# EAGLE schematic PiGateway2 (EAGLE 7.6.0)
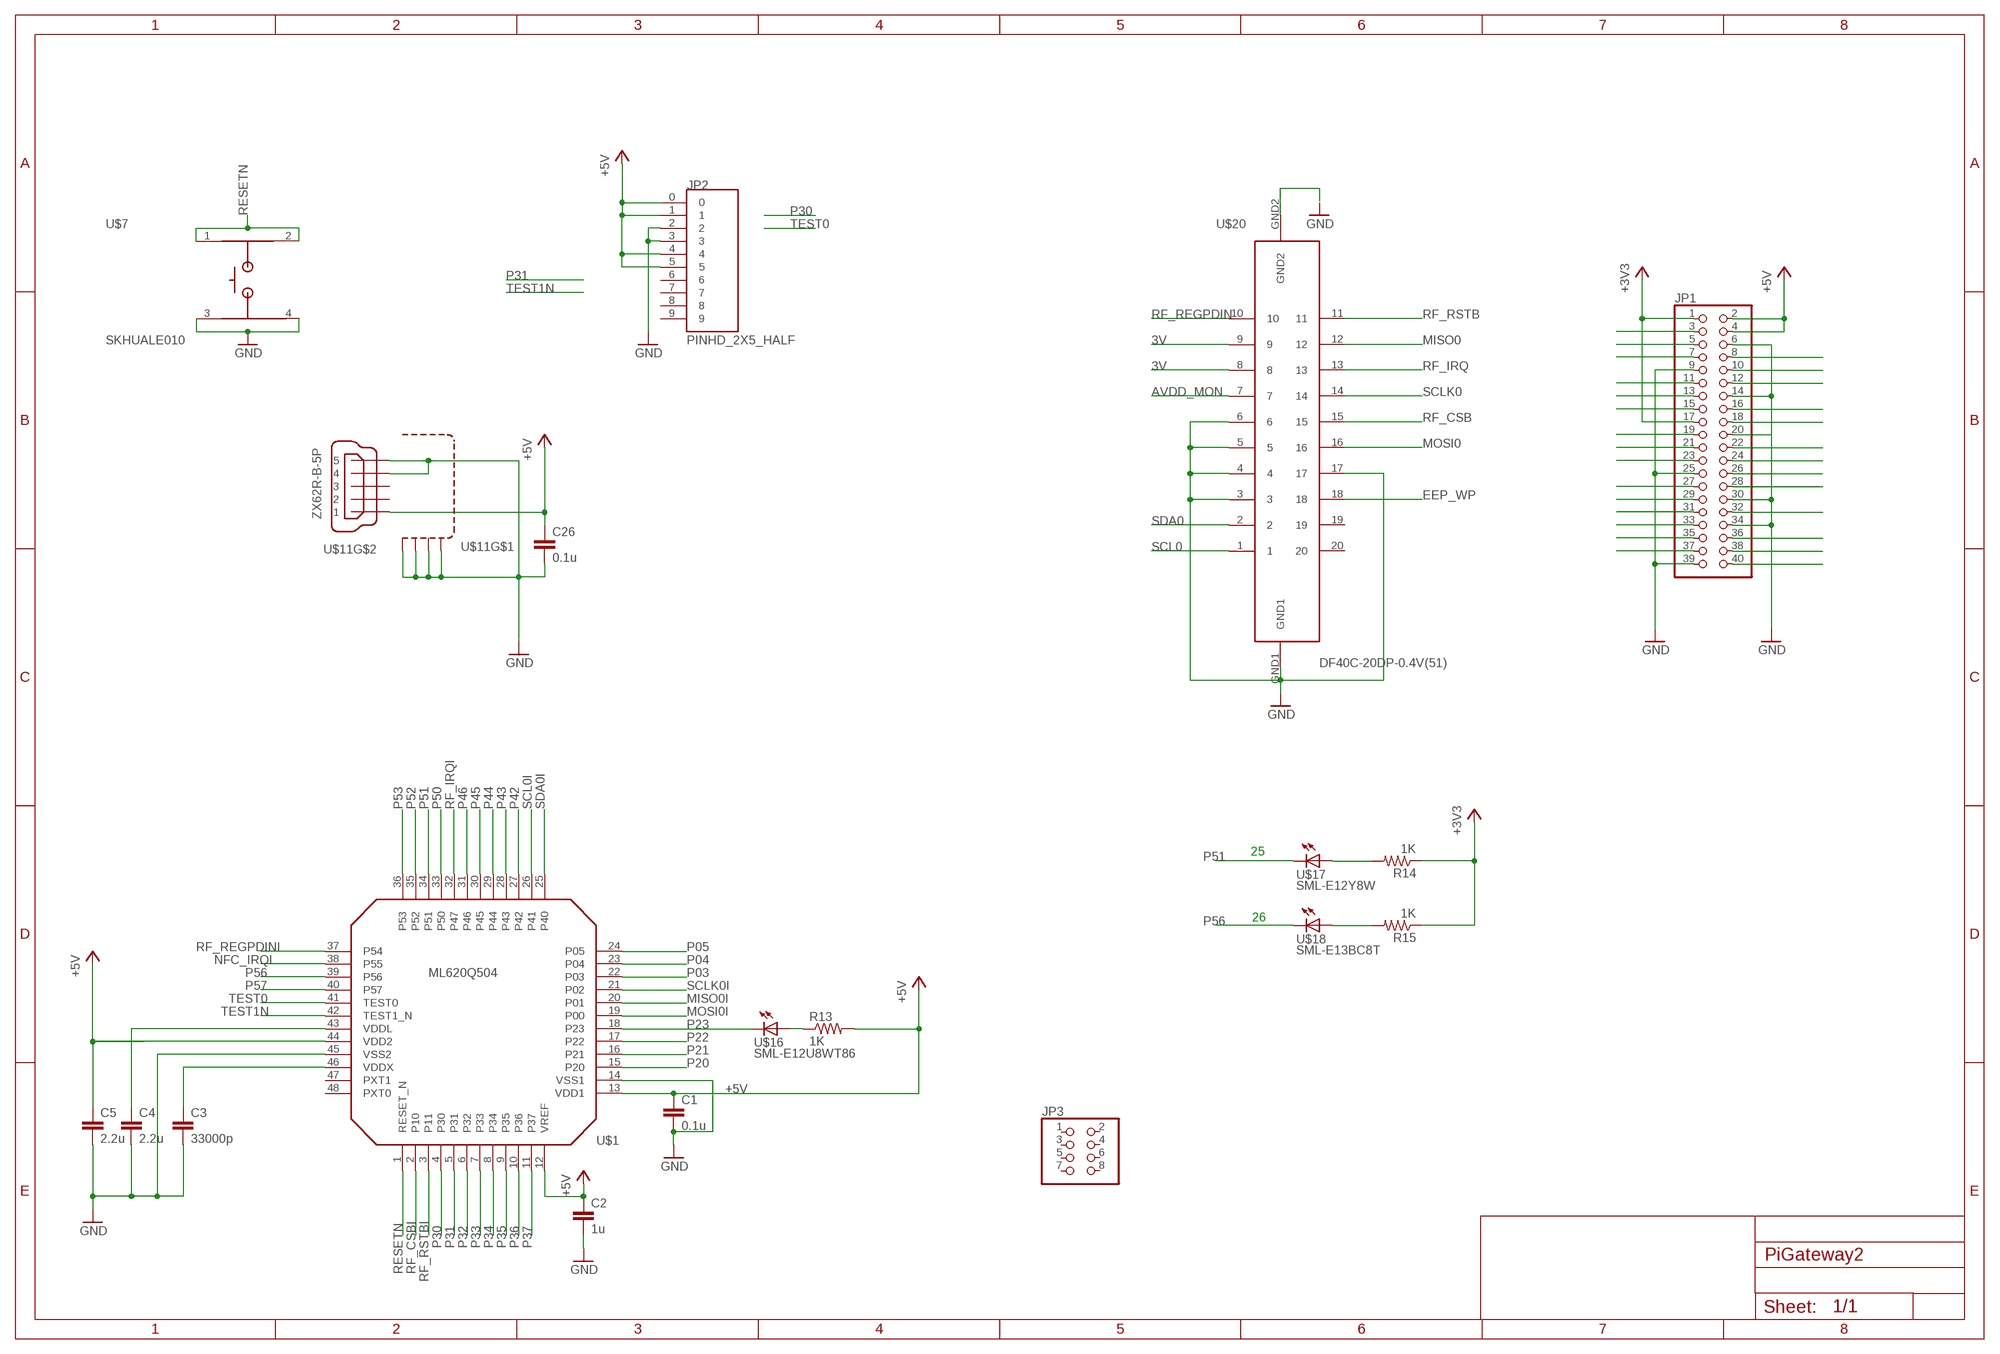
[diagram p0: schematic, sheet 1]

## Parts
C1  0.1u  C-EUC0402  [C0402]
C2  1u  C-EUC0402  [C0402]
C3  33000p  C-EUC0402  [C0402]
C4  2.2u  C-EUC0402  [C0402]
C5  2.2u  C-EUC0402  [C0402]
C26  0.1u  C-EUC0402  [C0402]
JP1  PINHD-2X20  [2X20]
JP2  PINHD_2X5_HALF  [PINHD_2X5_HALF]
JP3  PINHD-2X4  [2X04]
R13  1K  R-US_R0402  [R0402]
R14  1K  R-US_R0402  [R0402]
R15  1K  R-US_R0402  [R0402]
U$1  ML620Q504  [ML620Q504]
U$7  SKHUALE010  [SKHUALE010]
U$11  ZX62R-B-5P  MICRO-USB-SHIELD-ZX62R-B-5P  [ZX62R-B-5P]
U$16  SML-E12U8WT86  SML-E1X  [SML-E1X]
U$17  SML-E12Y8W  SML-E1X  [SML-E1X]
U$18  SML-E13BC8T  SML-E1X  [SML-E1X]
U$20  DF40C-20DP-0.4V(51)  BP3596A  [BP3596A]

## Nets
3V: U$20.8 U$20.9
+3V3: JP1.1 JP1.17 R14.1 R15.1
+5V: C1.1 C2.1 C5.1 C26.1 JP1.2 JP1.4 JP2.0 JP2.1 JP2.4 JP2.5 R13.2 U$1.12(VREF) U$1.13(VDD1) U$1.44(VDD2) U$11.1
AVDD_MON: U$20.7
EEP_WP: U$20.18
GND: C1.2 C2.2 C3.2 C4.2 C5.2 C26.2 JP1.6 JP1.9 JP1.14 JP1.20 JP1.25 JP1.30 JP1.34 JP1.39 JP2.2 JP2.3 U$1.14(VSS1) U$1.45(VSS2) U$7.3 U$7.4 U$11.4 U$11.5 U$11.M1(S1) U$11.M2(S2) U$11.M3(S3) U$11.M4(S4) U$20.3 U$20.4 U$20.5 U$20.6 U$20.17 U$20.GND1
MISO0: U$20.12
MISO0I: U$1.20(P01)
MOSI0: U$20.16
MOSI0I: U$1.19(P00)
N$3: C3.1 U$1.46(VDDX)
N$4: U$20.GND2
N$5: R14.2 U$17.A
N$6: R15.2 U$18.A
N$7: C4.1 U$1.43(VDDL)
N$8: R13.1 U$16.A
N$9: JP1.3
N$10: JP1.5
N$11: JP1.7
N$12: JP1.11
N$13: JP1.13
N$14: JP1.15
N$15: JP1.19
N$16: JP1.21
N$17: JP1.23
N$18: JP1.27
N$19: JP1.29
N$20: JP1.31
N$21: JP1.33
N$22: JP1.35
N$23: JP1.37
N$24: JP1.40
N$25: JP1.38
N$26: JP1.36
N$27: JP1.32
N$28: JP1.28
N$29: JP1.26
N$30: JP1.24
N$31: JP1.22
N$32: JP1.18
N$33: JP1.16
N$34: JP1.8
N$35: JP1.10
N$36: JP1.12
NFC_IRQI: U$1.38(P55)
P03: U$1.22(P03)
P04: U$1.23(P04)
P05: U$1.24(P05)
P20: U$1.15(P20)
P21: U$1.16(P21)
P22: U$1.17(P22)
P23: U$1.18(P23) U$16.C
P30: U$1.4(P30)
P31: U$1.5(P31)
P32: U$1.6(P32)
P33: U$1.7(P33)
P34: U$1.8(P34)
P35: U$1.9(P35)
P36: U$1.10(P36)
P37: U$1.11(P37)
P42: U$1.27(P42)
P43: U$1.28(P43)
P44: U$1.29(P44)
P45: U$1.30(P45)
P46: U$1.31(P46)
P50: U$1.33(P50)
P51: U$1.34(P51) U$17.C
P52: U$1.35(P52)
P53: U$1.36(P53)
P56: U$1.39(P56) U$18.C
P57: U$1.40(P57)
RESETN: U$1.1(RESET_N) U$7.1 U$7.2
RF_CSB: U$20.15
RF_CSBI: U$1.2(P10)
RF_IRQ: U$20.13
RF_IRQI: U$1.32(P47)
RF_REGPDIN: U$20.10
RF_REGPDINI: U$1.37(P54)
RF_RSTB: U$20.11
RF_RSTBI: U$1.3(P11)
SCL0: U$20.1
SCL0I: U$1.26(P41)
SCLK0: U$20.14
SCLK0I: U$1.21(P02)
SDA0: U$20.2
SDA0I: U$1.25(P40)
TEST0: U$1.41(TEST0)
TEST1N: U$1.42(TEST1_N)
Unconnected: JP2.6 JP2.7 JP2.8 JP2.9 JP3.1 JP3.2 JP3.3 JP3.4 JP3.5 JP3.6 JP3.7 JP3.8 U$1.47(PXT1) U$1.48(PXT0) U$11.2 U$11.3 U$20.19 U$20.20

## Notes on the sheet
- 25
- 26

## Library data of the parts
C1-C5 C26 = rcl:C-EU: CAPACITOR, European symbol
JP1 = pinhead:PINHD-2X20: PIN HEADER
JP2 = lazurite:PINHD_2X5_HALF
JP3 = pinhead:PINHD-2X4: PIN HEADER
R13-R15 = rcl:R-US_: RESISTOR, American symbol
U$1 = lazurite:ML620Q504
U$7 = lazurite:SKHUALE010
U$11 = con-hirose:MICRO-USB-SHIELD-: Hirose Micro USB Connector ZX62R-B-5P: Micro B, reverse (top mount) shell SMT Supplier: DigiKey H11574CT-ND Source: http://www.hirose.co.jp/cataloge_hp/e24200011.pdf
U$16-U$18 = lazurite:SML-E1X
U$20 = lazurite:BP3596A